# Altium project VCU.PrjPcb (part 4 of 4)

## Sheet Analog Inputs.SchDoc: Title
size A4; Project: Q24 VCU; ENG_APP_DATE: --/--/--; DSN_APP_DATE: --/--/--; CHK_APP_DATE: --/--/--; Date: *******; ApprovedBy: *******; CheckedBy: None; Author: *******; CompanyName: *******; DrawnBy: Jacob Chisholm; Engineer: *******; Organization: *******; Address1: *******; Address2: *******; Address3: *******; Address4: *******; DocumentNumber: 14; Revision: *******; SheetNumber: 14; SheetTotal: 14; Address_Website: https://jchisholm204.github.io; E-Mail: JacobChisholm1010@gmail.com; CurrentTime: *******; CurrentDate: *******; Time: *******; DocumentFullPathAndName: *******; DocumentName: *******; ModifiedDate: *******; ImagePath: *******; ProjectName: *******; Application_BuildNumber: *******
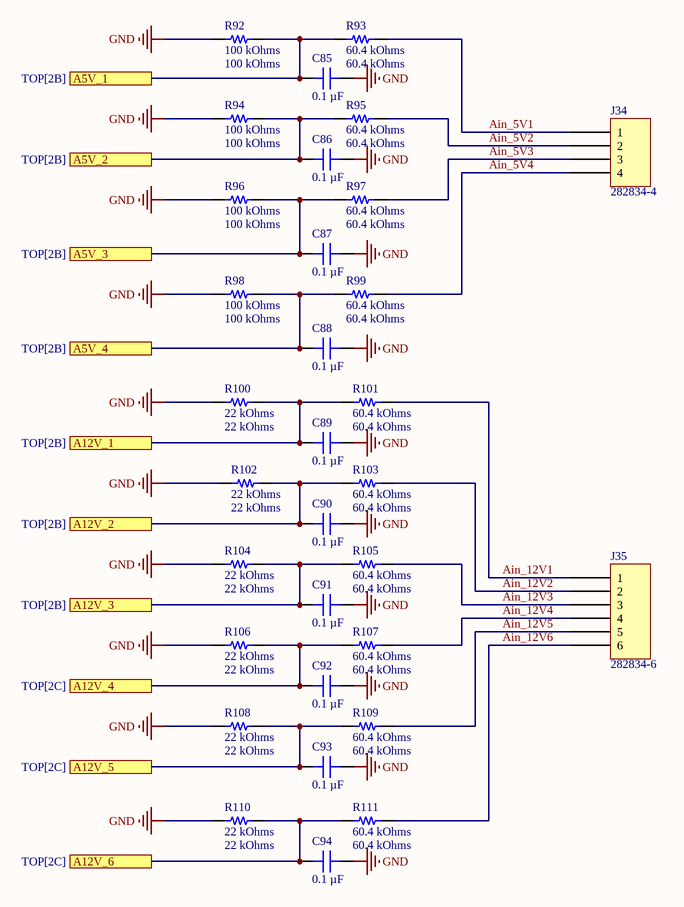
[diagram p13: Analog Inputs.SchDoc]

### Parts
C85  0.1 µF  [CAP 0603_1608]
C86  0.1 µF  [CAP 0603_1608]
C87  0.1 µF  [CAP 0603_1608]
C88  0.1 µF  [CAP 0603_1608]
C89  0.1 µF  [CAP 0603_1608]
C90  0.1 µF  [CAP 0603_1608]
C91  0.1 µF  [CAP 0603_1608]
C92  0.1 µF  [CAP 0603_1608]
C93  0.1 µF  [CAP 0603_1608]
C94  0.1 µF  [CAP 0603_1608]
J34  282834-4  [TE 282834-4]
J35  282834-6  [TE 282834-6]
R92  100 kOhms  [RES 0603_1608]
R93  60.4 kOhms  [RES 0603_1608]
R94  100 kOhms  [RES 0603_1608]
R95  60.4 kOhms  [RES 0603_1608]
R96  100 kOhms  [RES 0603_1608]
R97  60.4 kOhms  [RES 0603_1608]
R98  100 kOhms  [RES 0603_1608]
R99  60.4 kOhms  [RES 0603_1608]
R100  22 kOhms  [RES 0603_1608]
R101  60.4 kOhms  [RES 0603_1608]
R102  22 kOhms  [RES 0603_1608]
R103  60.4 kOhms  [RES 0603_1608]
R104  22 kOhms  [RES 0603_1608]
R105  60.4 kOhms  [RES 0603_1608]
R106  22 kOhms  [RES 0603_1608]
R107  60.4 kOhms  [RES 0603_1608]
R108  22 kOhms  [RES 0603_1608]
R109  60.4 kOhms  [RES 0603_1608]
R110  22 kOhms  [RES 0603_1608]
R111  60.4 kOhms  [RES 0603_1608]

### Ports
A5V_1 (see TOP[2B]), A5V_2 (see TOP[2B]), A5V_3 (see TOP[2B]), A5V_4 (see TOP[2B]), A12V_1 (see TOP[2B]), A12V_2 (see TOP[2B]), A12V_3 (see TOP[2B]), A12V_4 (see TOP[2C]), A12V_5 (see TOP[2C]), A12V_6 (see TOP[2C])

### Nets
GND: C85.2 C86.2 C87.2 C88.2 C89.2 C90.2 C91.2 C92.2 C93.2 C94.2 R92.1 R94.1 R96.1 R98.1 R100.2 R102.2 R104.2 R106.2 R108.2 R110.2
Ain_5V1: J34.1 R93.2
Ain_5V2: J34.2 R95.2
Ain_5V3: J34.3 R97.2
Ain_5V4: J34.4 R99.2
Ain_12V1: J35.1 R101.1
Ain_12V2: J35.2 R103.1
Ain_12V3: J35.3 R105.1
Ain_12V4: J35.4 R107.1
Ain_12V5: J35.5 R109.1
Ain_12V6: J35.6 R111.1
Analog_5V1: C85.1 R92.2 R93.1 ; port A5V_1
Analog_5V2: C86.1 R94.2 R95.1 ; port A5V_2
Analog_5V3: C87.1 R96.2 R97.1 ; port A5V_3
Analog_5V4: C88.1 R98.2 R99.1 ; port A5V_4
Analog_12V1: C89.1 R100.1 R101.2 ; port A12V_1
Analog_12V2: C90.1 R102.1 R103.2 ; port A12V_2
Analog_12V3: C91.1 R104.1 R105.2 ; port A12V_3
Analog_12V4: C92.1 R106.1 R107.2 ; port A12V_4
Analog_12V5: C93.1 R108.1 R109.2 ; port A12V_5
Analog_12V6: C94.1 R110.1 R111.2 ; port A12V_6

### Notes on the sheet
- Title:
- Drawn By:
- Page Contents:
- Checked By:
- Size:
- Date:
- File:
- License:
- Email:
- A4
- Number:
- Time:
- Revision:
- Sheet
- Website:
- of

### Library data of the parts
C85-C94 = 6R3X14W104MV4T: as C81-C84 on sheet Digital Inputs; Part Number: 6R3X14W104MV4T; Value: 0.1 µF; Applications: Bypass, Decoupling; Capacitance: 0.1 µF; componentlink1description: Datasheet; componentlink1url: https://www.johansondielectrics.com/downloads/x2y-filter-and-decoupling-capacitors.pdf; componentlink2description: DigiKey Link; componentlink2url: https://www.digikey.com/en/products/detail/johanson-dielectrics-inc/6R3X14W104MV4T/1556331; Device Package: 0603 (1608 Metric); Features: Low ESL (X2Y); lastupdated: 1/24/2024 8:09:44 PM; Lifecycle Status: Active; Minimum Order: 1; Mounting Type: Surface Mount, MLCC; Operating Temperature: -55°C ~ 125°C; Package / Case: 0603 (1608 Metric); packaging: TapeAndReel; partid: 2650; Part Status: Active; price: 0.08; series: X2Y®; Size / Dimension: 0.064" L x 0.035" W (1.63mm x 0.89mm); Supplier 1: DigiKey; Supplier Part Number 1: 709-1009-1-ND; Temperature Coefficient: X7R; Thickness (Max): 0.026" (0.66mm); Voltage - Rated: 6.3V
J34 = 282834-4: TERM BLK 4P SIDE ENT 2.54MM PCB; Manufacturer: TE Connectivity AMP Connectors; Current: 10A; Mating Orientation: Horizontal with Board; Number of Levels: 1; Pitch: 0.100" (2.54mm); Positions Per Level: 4; Voltage: 150V; Wire Gauge: 16-30 AWG; Wire Termination: Screw - Rising Cage Clamp; Part Number: 282834-4; Color: Green; ComponentLink1Description: Datasheet; ComponentLink1URL: https://www.te.com/commerce/DocumentDelivery/DDEController?Action=srchrtrv&DocNm=282834&DocType=Customer+Drawing&DocLang=English; ComponentLink2Description: DigiKey Link; ComponentLink2URL: http://digikey.com/product-detail/en/te-connectivity-amp-connectors/282834-4/A98335-ND/1153265; LastUpdated: 1/15/2020 4:16:05 AM; Lifecycle Status: Active; Minimum Order: 1; Mounting Type: Through Hole; Packaging: Bulk; Part Status: Active; Price: 2.68; Series: Buchanan; Supplier 1: DigiKey; Supplier Part Number 1: A98335-ND
J35 = 282834-6: TERM BLK 6P SIDE ENT 2.54MM PCB; Manufacturer: TE Connectivity AMP Connectors; Current: 10A; Mating Orientation: Horizontal with Board; Number of Levels: 1; Pitch: 0.100" (2.54mm); Positions Per Level: 6; Voltage: 150V; Wire Gauge: 16-30 AWG; Wire Termination: Screw - Rising Cage Clamp; Part Number: 282834-6; Color: Green; ComponentLink1Description: Datasheet; ComponentLink1URL: https://www.te.com/commerce/DocumentDelivery/DDEController?Action=srchrtrv&DocNm=282834&DocType=Customer+Drawing&DocLang=English; ComponentLink2Description: DigiKey Link; ComponentLink2URL: http://digikey.com/product-detail/en/te-connectivity-amp-connectors/282834-6/A98337-ND/1153267; LastUpdated: 1/15/2020 4:16:31 AM; Lifecycle Status: Active; Minimum Order: 1; Mounting Type: Through Hole; Packaging: Bulk; Part Status: Active; Price: 4.72; Series: Buchanan; Supplier 1: DigiKey; Supplier Part Number 1: A98337-ND
R92 R94 R96 R98 = AA0603FR-07100KL: RES SMD 100K OHM 1% 1/10W 0603; Part Number: AA0603FR-07100KL; Value: 100 kOhms
R93 R95 R97 R99 R101 R103 R105 R107 R109 R111 = AC0603FR-0760K4L: RES SMD 60.4K OHM 1% 1/10W 0603; Part Number: AC0603FR-0760K4L; Value: 60.4 kOhms
R100 R102 R104 R106 R108 R110 = AC0603FR-7W22KL: RES 22K OHM 1% 1/5W 0603; Part Number: AC0603FR-7W22KL; Value: 22 kOhms

## Nets that join several sheets
5VCC: MCU (U1.3), Power (7 pins), 24V_Load_Switches (U6.10 U6.13 U6.16), 12V_Load_Switches (U26.10 U26.13 U26.16), 5V_Load_Switches (21 pins), 24V_FETS (U13.4 U15.4 U15.7), Indicators (6 pins)
12VCC: Power (R49.2 R52.1 U32.2), 12V_Load_Switches (18 pins), 24V_FETS (6 pins)
24VCC: Power (7 pins), 24V_Load_Switches (24 pins)
GND: MCU (30 pins), CAN (R6.1 R7.1 U2.2 U3.2), EEPROM (U38.1 U38.2 U38.3 U38.4), Power (13 pins), 12V_Buck (20 pins), 5V_Buck (14 pins), 24V_Load_Switches (49 pins), 12V_Load_Switches (37 pins), 5V_Load_Switches (31 pins), 24V_FETS (22 pins), Indicators (14 pins), Digital Inputs (12 pins), Analog Inputs (20 pins)
5V_MCU_SENSE: MCU (IC1.24), Power (C65.2 R55.2 R56.1)
5VREG_IN: Power (F6.2_1 F6.2_2), 5V_Buck (Q8.5-6-7-8 U35.12 U35.19)
5VREG_VOUT: Power (F7.1_1 F7.1_2), 5V_Buck (C80.1 R68.2 U35.21)
12V_MCU_SENSE: MCU (IC1.23), Power (C64.2 R52.2 R53.1)
12V_REG_EN: MCU (IC1.93), 12V_Buck (R57.1 U34.1)
12VREG_IN: Power (F4.2_1 F4.2_2), 12V_Buck (6 pins)
12VREG_OUT: Power (F5.1_1 F5.1_2), 12V_Buck (6 pins)
24V_MCU_SENSE: MCU (IC1.18), Power (C63.2 R50.2 R51.1)
Analog_5V1: MCU (IC1.30), Analog Inputs (C85.1 R92.2 R93.1)
Analog_5V2: MCU (IC1.29), Analog Inputs (C86.1 R94.2 R95.1)
Analog_5V3: MCU (IC1.26), Analog Inputs (C87.1 R96.2 R97.1)
Analog_5V4: MCU (IC1.25), Analog Inputs (C88.1 R98.2 R99.1)
Analog_12V1: MCU (IC1.36), Analog Inputs (C89.1 R100.1 R101.2)
Analog_12V2: MCU (IC1.35), Analog Inputs (C90.1 R102.1 R103.2)
Analog_12V3: MCU (IC1.34), Analog Inputs (C91.1 R104.1 R105.2)
Analog_12V4: MCU (IC1.33), Analog Inputs (C92.1 R106.1 R107.2)
Analog_12V5: MCU (IC1.32), Analog Inputs (C93.1 R108.1 R109.2)
Analog_12V6: MCU (IC1.31), Analog Inputs (C94.1 R110.1 R111.2)
CAN1_RX: MCU (IC1.70), CAN (U2.4)
CAN1_TX: MCU (IC1.71), CAN (U2.1)
CAN2_RX: MCU (IC1.91), CAN (U3.4)
CAN2_TX: MCU (IC1.92), CAN (U3.1)
Din_1: MCU (IC1.15), Digital Inputs (C83.1 R88.2 R89.1)
Din_2: MCU (IC1.16), Digital Inputs (C82.1 R86.2 R87.1)
Din_3: MCU (IC1.17), Digital Inputs (C81.1 R84.2 R85.1)
Din_4: MCU (IC1.41), Digital Inputs (C84.1 R90.2 R91.1)
EEPROM_WL: MCU (IC1.43), EEPROM (U38.7)
F1_HIGH: MCU (IC1.1), 24V_FETS (D10.1 U14.1)
F1_LOW: MCU (IC1.4), 24V_FETS (U14.2)
F2_HIGH: MCU (IC1.2), 24V_FETS (D12.1 U16.1)
F2_LOW: MCU (IC1.3), 24V_FETS (U16.2)
I2C2.SCL: MCU (IC1.47 J2.1 R2.1), EEPROM (U38.6), Power (U31.5 U32.5 U32.7 U33.5)
I2C2.SDA: MCU (IC1.80 J2.2 R3.1), EEPROM (U38.5), Power (U31.6 U31.7 U32.6 U33.6)
I2C3_SCL: MCU (IC1.67 J3.1 R4.1), 24V_FETS (U13.5 U15.5)
I2C3_SDA: MCU (IC1.66 J3.2 R5.1), 24V_FETS (U13.6 U15.6)
Indicator_LED_BLU: MCU (IC1.57), Indicators (D28.1)
Indicator_LED_GRN: MCU (IC1.58), Indicators (D27.1)
Indicator_LED_RED: MCU (IC1.61), Indicators (D25.1)
Indicator_LED_YEL: MCU (IC1.60), Indicators (D26.1)
Indicator_SEG1A: MCU (IC1.82), Indicators (U36.7)
Indicator_SEG1B: MCU (IC1.85), Indicators (U36.1)
Indicator_SEG1C: MCU (IC1.84), Indicators (U36.2)
Indicator_SEG1D: MCU (IC1.83), Indicators (U36.6)
Indicator_SEG2A: MCU (IC1.95), Indicators (U37.7)
Indicator_SEG2B: MCU (IC1.98), Indicators (U37.1)
Indicator_SEG2C: MCU (IC1.97), Indicators (U37.2)
Indicator_SEG2D: MCU (IC1.96), Indicators (U37.6)
PWM_In1: MCU (IC1.40), Digital Inputs (R76.1 R77.2)
PWM_In2: MCU (IC1.77), Digital Inputs (R78.1 R79.2)
PWM_In3: MCU (IC1.90), Digital Inputs (R80.1 R81.2)
PWM_In4: MCU (IC1.59), Digital Inputs (R82.1 R83.2)
SPI2_MOSI: MCU (IC1.54), 24V_Load_Switches (U6.14), 12V_Load_Switches (U26.14), 5V_Load_Switches (U18.14)
SPI2_SCK: MCU (IC1.52), 24V_Load_Switches (U6.12), 12V_Load_Switches (U26.12), 5V_Load_Switches (U18.12)
SR_Latch_5V_LS: MCU (IC1.46), 5V_Load_Switches (U18.11)
SR_Latch_12V_LS: MCU (IC1.81), 12V_Load_Switches (U26.11)
SR_Latch_24V_LS: MCU (IC1.44), 24V_Load_Switches (U6.11)
ST_3V3: MCU (27 pins), CAN (U2.3 U3.3), EEPROM (U38.8)